# EAGLE design tappy_corner (EAGLE 6.5.0)

## Sheet 1 of 2
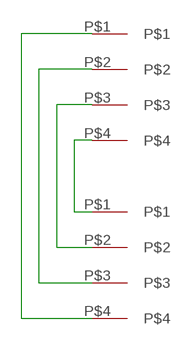
[diagram p0: schematic, sheet 1]

### Parts
U$3  4PAD  [4PAD]
U$4  4PAD  [4PAD]

### Nets
N$1: U$3.P$4 U$4.P$1
N$2: U$3.P$3 U$4.P$2
N$3: U$3.P$2 U$4.P$3
N$4: U$3.P$1 U$4.P$4

## Sheet 2 of 2

## Library data of the parts
U$3 U$4 = Sparky:4PAD

## Board
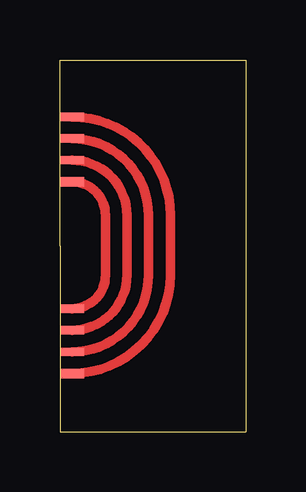
[diagram p1: board, top side]

Size 7.75 x 15.5 mm. Coordinates in mm from the lower left corner, seen from the top.
Outline: 0,7.75 0,0 7.75,0 7.75,7.75 7.75,15.5 0,15.5 0,7.75
Copper layers (1*16): Top 0.035mm / dielectric 1.5mm / Bottom 0.035mm
Design rules "default": minimum track width 10mil, minimum drill 24mil, track to track 8mil, track to pad 8mil, pad to pad 8mil, via to via 8mil, smd to smd 8mil, copper to edge 40mil, drill to drill 8mil, minimum pad ring 10mil, minimum via ring 8mil, stop-mask expansion 4mil, vias tented up to drill 0mil, thermal gap 10mil

### Footprints (pad centres in the part's own frame; a part is rotated, then mirrored left to right if it is on the bottom)
4PAD = smd 1 x 0.4: P$1 0,0.3 | smd 1 x 0.35: P$2 0,1.2; P$3 0,2.1; P$4 0,3

### Placement (x,y rotation side)
U$3  0.5,2.12 0 top
U$4  0.5,10.12 0 top

### Tracks (layer width: path | path; a pad name or v marks a point on that pad's centre or on a via)
N$1
  Top 0.305: U$4.P$1
  Top 0.4: U$3.P$4 arc90 1.9,6.53 1.9,9.02 arc90 U$4.P$1
N$2
  Top 0.305: U$4.P$2
  Top 0.4: U$3.P$3 arc90 2.8,6.53 2.8,9.02 arc90 U$4.P$2
N$3
  Top 0.305: U$4.P$3
  Top 0.4: U$3.P$2 arc90 3.7,6.53 3.7,9.02 arc90 U$4.P$3
N$4
  Top 0.305: 0.52,13.12 U$4.P$4
  Top 0.4: U$3.P$1 arc90 4.61,6.52 4.61,9.02 arc90 0.52,13.12